# Altium project LIDAR_CAN_MODULES_PRJ.PrjPcb
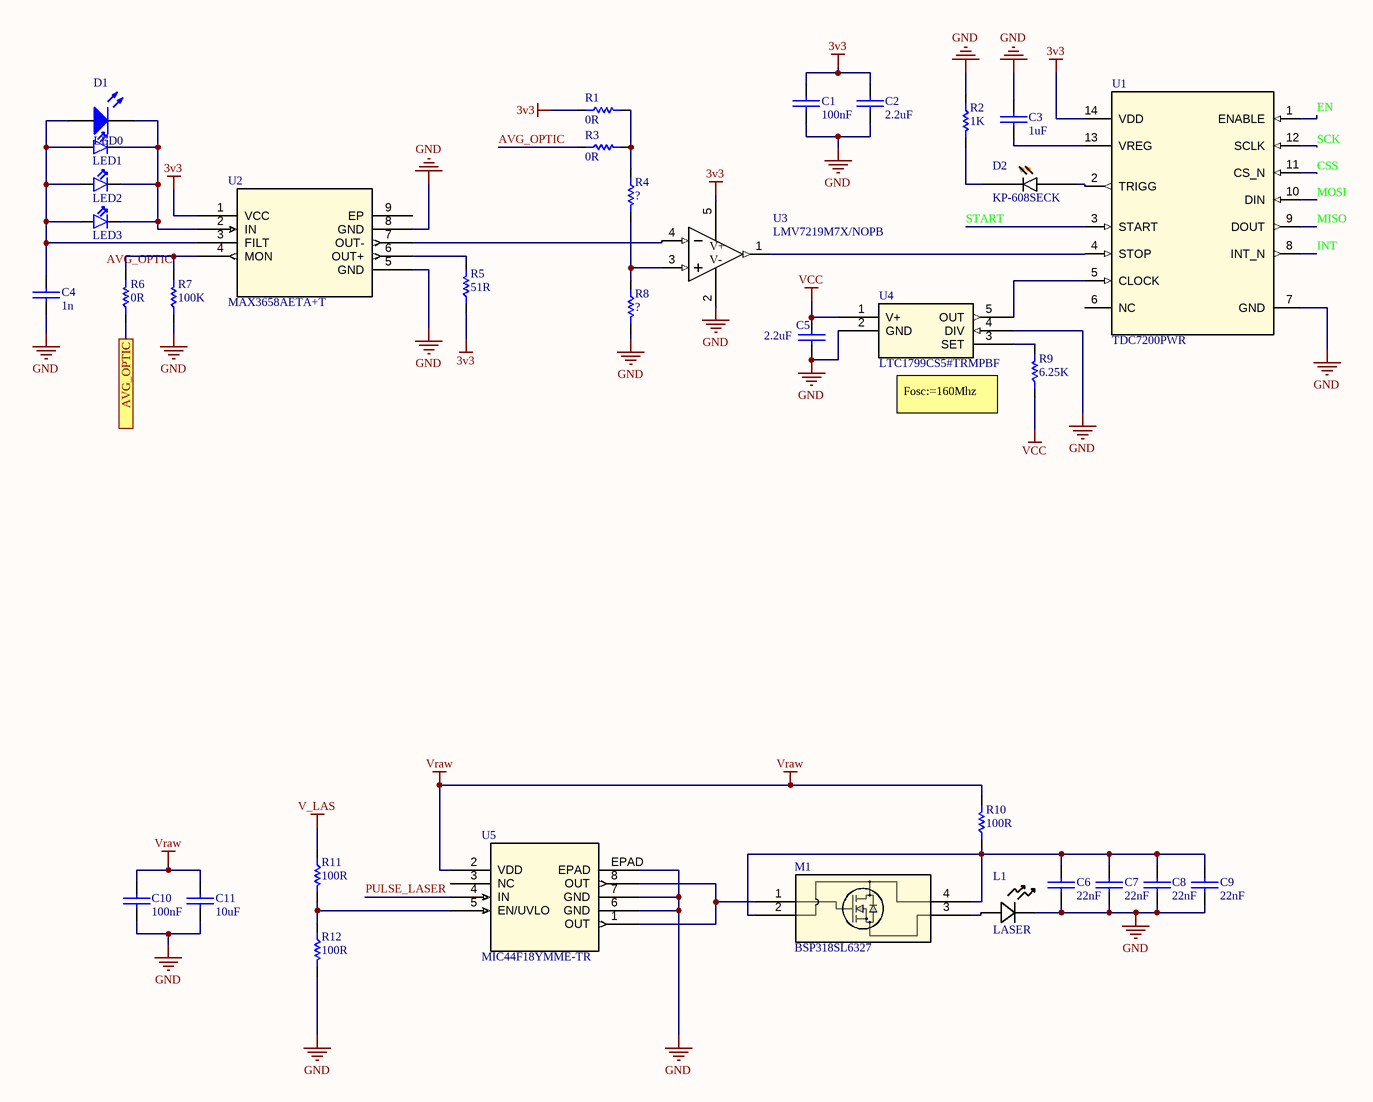
[diagram p0: LIDAR_CAN_MODULES_SCH.SchDoc]
1 sheet, 35 parts. Net scope: flat (ports and power ports of the same name join across sheets).
Board file: LIDAR_CAN_MODULES_PCB.PcbDoc

## Sheet LIDAR_CAN_MODULES_SCH.SchDoc
size 420 x 297 mm; SheetNumber: 1; SheetTotal: 1

### Parts
C1  value 100nF  [SMD_CAP_0603]
C2  value 2.2uF  [SMD_CAP_0603]
C3  value 1uF  [SMD_CAP_0603]
C4  value 1n  [SMD_CAP_0603]
C5  value 2.2uF  [SMD_CAP_0603]
C6  value 22nF  [SMD_CAP_0603]
C7  value 22nF  [SMD_CAP_0603]
C8  value 22nF  [SMD_CAP_0603]
C9  value 22nF  [SMD_CAP_0603]
C10  value 100nF  [SMD_CAP_0603]
C11  value 10uF  [SMD_CAP_0603]
D1  LED0  [LED-0]
D2  KP-608SECK  [*LEDM1608X80_LTE-C1906R-14(Primary)]
L1  LASER  [SPL-PL90]
LED1  LED  [LED1206]  (value not drawn)
LED2  LED  [LED0805]  (value not drawn)
LED3  LED  [LED0603]  (value not drawn)
M1  BSP318SL6327  [PG-SOT223-4_INF-L]
R1  0R  [RES 0603 (1608X06L)]
R2  1K  [RES 0603 (1608X06L)]
R3  0R  [RES 0603 (1608X06L)]
R4  ?  [RES 0603 (1608X06L)]
R5  51R  [RES 0603 (1608X06L)]
R6  0R  [RES 0603 (1608X06L)]
R7  100K  [RES 0603 (1608X06L)]
R8  ?  [RES 0603 (1608X06L)]
R9  6.25K  [RES 0603 (1608X06L)]
R10  100R  [RES 1210 (3226X07L)]
R11  100R  [RES 0603 (1608X06L)]
R12  100R  [RES 0603 (1608X06L)]
U1  TDC7200PWR  [PW0014A_L]
U2  MAX3658AETA+T  [21-0137I_T833-3_MXM]
U3  LMV7219M7X/NOPB  [SOT-5_S_LIT]
U4  LTC1799CS5#TRMPBF  [SOT-5_S_LIT]
U5  MIC44F18YMME-TR  [MSOP-8_MME_MCH]

### Ports
AVG_OPTIC

### Nets
3v3: C1.1(+) C2.1(+) R1.1 R5.1 U1.14(VDD) U2.1(VCC) U3.5(V+)
GND: C1.2(-) C2.2(-) C3.1(+) C4.2(-) C5.2(-) C6.2(-) C7.2(-) C8.2(-) C9.2(-) C10.2(-) C11.2(-) L1.1 R2.1 R7.1 R8.2 R12.2 U1.7(GND) U2.5(GND) U2.8(GND) U3.2(V-) U4.2(GND) U4.4(DIV) U5.6(GND) U5.7(GND) U5.EPAD
V_LAS: R11.1
VCC: C5.1(+) R9.1 U4.1(V+)
Vraw: C10.1(+) C11.1(+) R10.2 U5.2(VDD)
AVG_OPTIC: R3.1 R6.2 R7.2 U2.4(MON)
CSS: U1.11(CS_N)
EN: U1.1(ENABLE)
INT: U1.8(INT_N)
MISO: U1.9(DOUT)
MOSI: U1.10(DIN)
PULSE_LASER: U5.4(IN)
SCK: U1.12(SCLK)
START: U1.3(START)
NetC3_2: C3.2(-) U1.13(VREG)
NetC4_1: C4.1(+) D1.1(A) LED1.1(A) LED2.1(A) LED3.1(A) U2.3(FILT)
NetC6_1: C6.1(+) C7.1(+) C8.1(+) C9.1(+) M1.2 M1.4 R10.1
NetD1_2: D1.2(K) LED1.2(K) LED2.2(K) LED3.2(K) U2.2(IN)
NetD2_A: D2.A U1.2(TRIGG)
NetD2_C: D2.C R2.2
NetL1_2: L1.2 M1.3
NetM1_1: M1.1 U5.1(OUT) U5.8(OUT)
NetR1_2: R1.2 R3.2 R4.1
NetR4_2: R4.2 R8.1 U3.3(IN+)
NetR5_2: R5.2 U2.6(OUT+)
NetR6_1: R6.1 ; port AVG_OPTIC
NetR9_2: R9.2 U4.3(SET)
NetR11_2: R11.2 R12.1 U5.5(EN/UVLO)
NetU1_4: U1.4(STOP) U3.1(OUT)
NetU1_5: U1.5(CLOCK) U4.5(OUT)
NetU2_7: U2.7(OUT-) U3.4(IN-)

Not connected (* = marked no-connect by the designer): U1 6(NC); U2 9(EP); U5 3(NC)

### Notes on the sheet
- Fosc:=160Mhz
- THIS DOCUMENT AND THE DATA DISCLOSED HEREIN OR
- HEREWITH IS THE PROPERTY OF ALTIUM LIMITED AND MAY
- DWG NO:
- REVISION
- REV:
- DESCRIPTION
- DATE
- APPROVED
- BE FREELY DISTRIBUTED IN WHOLE. NO RIGHTS ARE
- RESERVED OR EXPRESS OR IMPLIED WARANTEE GIVEN.
- ENG:
- APPROVALS
- PROJECT
- DSN:
- CHK:
- REFERENCE DOCUMENTS
- PROJECT REVISION:
- TITLE
- DOCUMENT REVISION:
- DESIGN ITEM:
- BOM:
- FAB DWG:
- PCB DWG:
- ASSY DWG:
- SCALE:
- A3
- SIZE
- CAGE CODE
- FILE NAME
- DWG NO.
- SHEET
- OF
- REV

### Library data of the parts
C1-C11 = Cap-Bipolar: Bipolar Capacitor; Voltage: 100V; Designer: Saeid Jorablo; Organazation: ControTec; Adding Date: 1387/12/20
D1 = LED0: Typical INFRARED GaAs LED; Published: 8-Jun-2000; LatestRevisionDate: 08-Jul-2005; LatestRevisionNote: Mech Layer 1 removed.; PackageReference: LED-0; Publisher: Altium Limited; PackageDescription: LED; 2 Leads
D2 = 0603-LED-ORANGE: Orange 605nm LED Indication - Discrete 2.2V 0603 (1608 Metric); MP: SML-D12D1WT86 or LTST-C194KFKT; Type: SMD; Package: 0603 Lite-On; SnapEDA_Link: https://www.snapeda.com/parts/SML-D12D1WT86/Rohm/view-part/?ref=search&t=0603%20LED%20orange; Value: *
L1 = SPL-PL90: 5mm Laser beam transmitter; Designer: EhsanShaghaei; ChipDip_Link: https://www.chipdip.ru/product0/8001775090
LED1-LED3 = LED: Designer :: Razi Research Team Of Mashhad - Hamed Jafarzadeh
M1 = BSP318SL6327: No Description Available; Vendor: Infineon; Built_By: EMA_Cory; SourceLibrary: Add_to_database_2021-03-11; Designer: EhsanShaghaei; Datasheet: https://www.mouser.com/datasheet/2/196/Infineon-BSP318S-DS-v02_04-en-522823.pdf; Manufacturer_Part_Number: BSP318SL6327; Copyright: Copyright (C) 2018 Accelerated Designs. All rights reserved; RefDes: RefDes; Type: DEV; ChipDip_Link: https://www.chipdip.ru/product0/8001781161
R1-R12 = Resistor: Tolerance: 5%; Power: 1/8 W
  R1 R3 R6: Value: 0R
  R2: Value: 1K
  R4 R8: Value: ?
  R5: Value: 51R
  R7: Value: 100K
  R9: Value: 6.25K
  R10-R12: Value: 100R
U1 = TDC7200PWR: Designer: Ehsan Shaghaei; ChipDip_Link: https://www.chipdip.ru/product1/8002200734
U2 = MAX3658AETA+T: Vendor: Maxim Integrated Products; Built_By: EMA_UL_Team; SourceLibrary: Maxim_2014-06-20; Designer: Ehsan Shaghaei; Manufacturer_Part_Number: MAX3658AETA+T; Revision: 1; Copyright: Copyright (C) 2018 Accelerated Designs. All rights reserved; RefDes: RefDes; Type: DEV; ChipDip_Link: https://www.chipdip.ru/product/max3658aeta-t
U3 = LMV7219M7X/NOPB: Manufacturer: NationalSemiconductor; Characteristics: LMV7219M77nsec27Vto5VcomparatorwithRail-to-RailOutput; CompType: ComparatorIC; TaMin_C: -400; TaMax_C: 850; ComponentLink1DescBC: LMV7219Datasheet; ComponentLink2DescA4: LMV7219WebPage; ComponentLink3DescAC: MAA05APackageWebPage; Designer: EhsanShaghaei; Copyright: Copyright (C) 2018 Accelerated Designs. All rights reserved; SymbolVersion: 2008-07-09; PartNumber: LMV7219M7; PackageDescription: 5LeadSC-70; PackageReference: MAA05A_L; RoHS: O; ComponentLink1URL: http//wwwnationalcom/ds/LM/LMV7219pdf; ComponentLink2URL: http//wwwnationalcom/pf/LM/LMV7219html; ComponentLink3URL: http//wwwnationalcom/packaging/folders/maa05ahtml; Version: B1608; LatestRevisionDate: 2009-03-16; LatestRevisionNote: MassUpdate; Publisher: NationalSemiconductor; Published: 2009-03-16; ChipDip_Link: https://www.chipdip.ru/product0/8005529462; ComponentLink1Description: New link; ComponentLink1URL: *
U4 = LTC1799CS5: Vendor: Linear Technology; Built_By: EMA_UL_Team; SourceLibrary: LinearTech_2016_03_08; Manufacturer_Part_Number: LTC1799CS5#TRMPBF; Copyright: Copyright (C) 2018 Accelerated Designs. All rights reserved; RefDes: RefDes; Type: DEV; ComponentLink1Description: ChipDip_Link; ComponentLink1URL: https://www.chipdip.ru/product1/8002977151; ComponentLink2Description: Designer; ComponentLink2URL: Ehsan Shaghaei
U5 = MIC44F18YMME-TR: No Description Available; Vendor: Microchip; Built_By: EMA_Molly; SourceLibrary: Microchip_2019-09-03; Designer: Ehsan Shaghaei; Manufacturer_Part_Number: MIC44F18YMME-TR; Copyright: Copyright (C) 2018 Accelerated Designs. All rights reserved; RefDes: RefDes; Type: DEV; ChipDip_Link: https://www.chipdip.ru/product/mic44f18ymme